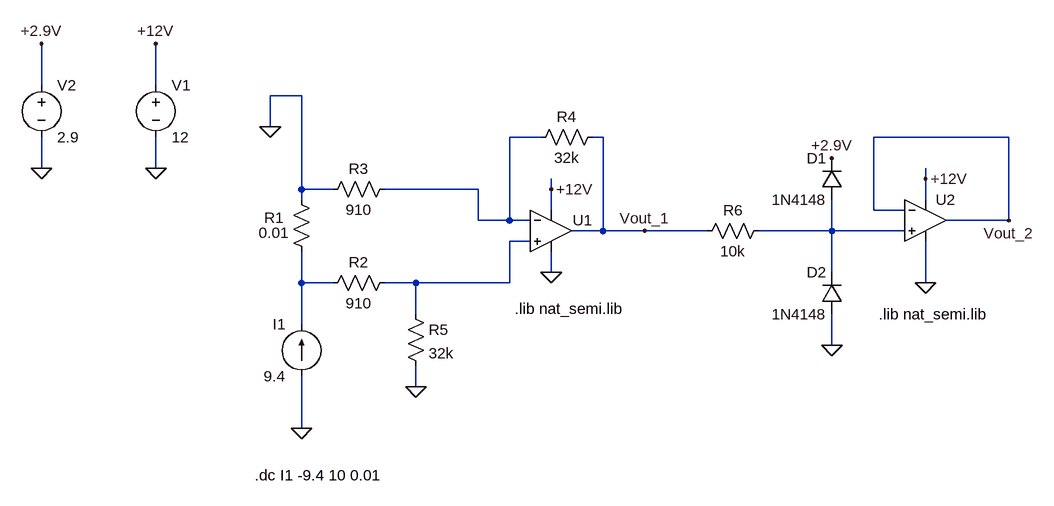
[diagram p0: schematic current_protection.asc]
current_protection.asc, the LTspice schematic file:
Version 4
SHEET 1 1204 680
WIRE -688 -336 -688 -400
WIRE -512 -336 -512 -400
WIRE -288 -320 -336 -320
WIRE -336 -272 -336 -320
WIRE 80 -256 32 -256
WIRE 176 -256 160 -256
WIRE 800 -256 592 -256
WIRE -688 -208 -688 -256
WIRE -512 -208 -512 -256
WIRE 672 -192 672 -208
WIRE -288 -176 -288 -320
WIRE -240 -176 -288 -176
WIRE -16 -176 -160 -176
WIRE 96 -176 96 -192
WIRE -288 -160 -288 -176
WIRE 672 -160 672 -192
WIRE 96 -144 96 -176
WIRE 592 -144 592 -256
WIRE 640 -144 592 -144
WIRE -16 -128 -16 -176
WIRE 32 -128 32 -256
WIRE 32 -128 -16 -128
WIRE 64 -128 32 -128
WIRE 800 -128 800 -256
WIRE 800 -128 704 -128
WIRE 176 -112 176 -256
WIRE 176 -112 128 -112
WIRE 240 -112 176 -112
WIRE 336 -112 240 -112
WIRE 528 -112 528 -160
WIRE 528 -112 416 -112
WIRE 640 -112 528 -112
WIRE 64 -96 32 -96
WIRE 96 -48 96 -80
WIRE 528 -48 528 -112
WIRE -288 -32 -288 -80
WIRE -240 -32 -288 -32
WIRE -112 -32 -160 -32
WIRE 32 -32 32 -96
WIRE 32 -32 -112 -32
WIRE 672 -32 672 -96
WIRE -112 16 -112 -32
WIRE -288 32 -288 -32
WIRE 528 64 528 16
WIRE -112 128 -112 96
WIRE -288 192 -288 112
FLAG -288 192 0
FLAG -512 -208 0
FLAG -112 128 0
FLAG 96 -48 0
FLAG -512 -400 +12V
FLAG 96 -176 +12V
FLAG -336 -272 0
FLAG 672 -192 +12V
FLAG 672 -32 0
FLAG 528 64 0
FLAG 800 -128 Vout_2
FLAG 528 -224 +2.9V
FLAG -688 -208 0
FLAG -688 -400 +2.9V
FLAG 240 -112 Vout_1
SYMBOL voltage -512 -352 R0
SYMATTR InstName V1
SYMATTR Value 12
SYMBOL current -288 112 R180
WINDOW 0 24 80 Left 2
WINDOW 3 24 0 Left 2
SYMATTR InstName I1
SYMATTR Value 9.4
SYMBOL res -304 -176 R0
WINDOW 0 -41 44 Left 2
WINDOW 3 -50 67 Left 2
SYMATTR InstName R1
SYMATTR Value 0.01
SYMBOL Opamps\\UniversalOpAmp 96 -112 R0
WINDOW 0 64 -16 Right 2
SYMATTR InstName U1
SYMBOL res -256 -16 R270
WINDOW 0 32 56 VTop 2
WINDOW 3 0 56 VBottom 2
SYMATTR InstName R2
SYMATTR Value 910
SYMBOL res -256 -160 R270
WINDOW 0 32 56 VTop 2
WINDOW 3 0 56 VBottom 2
SYMATTR InstName R3
SYMATTR Value 910
SYMBOL res -128 0 R0
SYMATTR InstName R5
SYMATTR Value 32k
SYMBOL res 64 -240 R270
WINDOW 0 32 56 VTop 2
WINDOW 3 0 56 VBottom 2
SYMATTR InstName R4
SYMATTR Value 32k
SYMBOL diode 544 -160 R180
WINDOW 0 24 64 Left 2
WINDOW 3 24 0 Left 2
SYMATTR InstName D1
SYMATTR Value 1N4148
SYMBOL diode 544 16 R180
WINDOW 0 24 64 Left 2
WINDOW 3 24 0 Left 2
SYMATTR InstName D2
SYMATTR Value 1N4148
SYMBOL res 432 -128 R90
WINDOW 0 0 56 VBottom 2
WINDOW 3 32 56 VTop 2
SYMATTR InstName R6
SYMATTR Value 10k
SYMBOL OpAmps\\UniversalOpAmp 672 -128 R0
SYMATTR InstName U2
SYMBOL voltage -688 -352 R0
SYMATTR InstName V2
SYMATTR Value 2.9
TEXT -360 264 Left 2 !.dc I1 -9.4 10 0.01
TEXT 40 8 Left 2 !.lib nat_semi.lib
TEXT 600 16 Left 2 !.lib nat_semi.lib

The netlist it stands for:
* current_protection.asc
V1 +12V 0 12
I1 0 N004 9.4
R1 0 N004 0.01
XU1 N003 N001 +12V 0 Vout_1 level1 Avol=1Meg GBW=10Meg Vos=0 En=0 Enk=0 In=0 Ink=0 Rin=500Meg  ; pins In+ In- V+ V- OUT
R2 N004 N003 910
R3 0 N001 910
R5 N003 0 32k
R4 N001 Vout_1 32k
D1 N002 +2.9V 1N4148
D2 0 N002 1N4148
R6 N002 Vout_1 10k
XU2 N002 Vout_2 +12V 0 Vout_2 level1 Avol=1Meg GBW=10Meg Vos=0 En=0 Enk=0 In=0 Ink=0 Rin=500Meg  ; pins In+ In- V+ V- OUT
V2 +2.9V 0 2.9
.model D D
.lib standard.dio
.dc I1 -9.4 10 0.01
.lib nat_semi.lib
.lib nat_semi.lib
.lib UniversalOpAmp1.lib
.backanno
.end

* Results of the author's LTspice run, read from the files saved beside the schematic
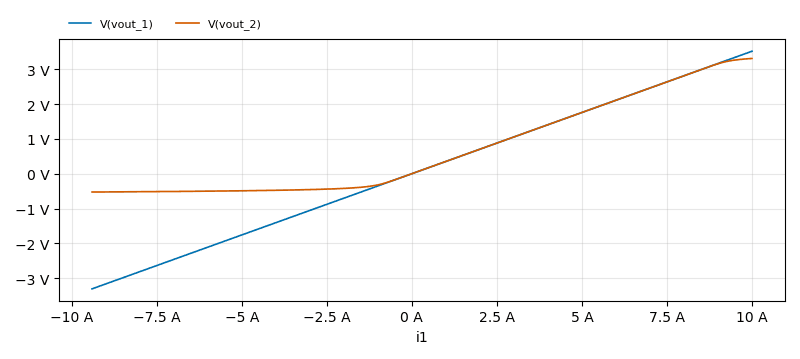
[diagram p1: DC transfer characteristic of current_protection.asc, plotted from the saved traces]
* DC transfer characteristic, 1 run:
*   V(vout_1): -3.305 V at i1=-9.4 A, 3.516 V at i1=10 A, min -3.305 V, max 3.516 V
*   V(vout_2): -526.3 mV at i1=-9.4 A, 3.309 V at i1=10 A, min -526.3 mV, max 3.309 V